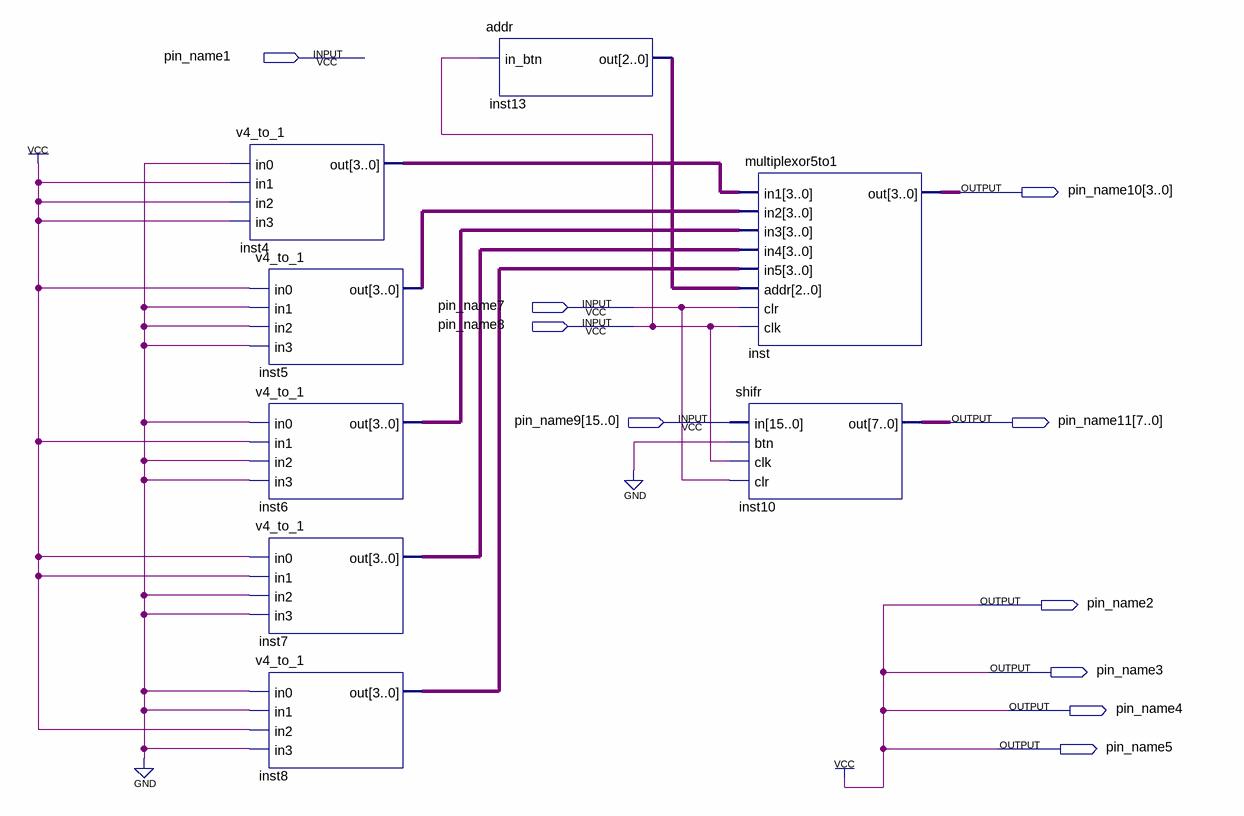
[diagram p0: schematic sheet]
// Quartus schematic lab3.bdf as structural Verilog: 8 symbols, 10 pins
module lab3 (
  input  pin_name1,
  input  pin_name7,
  input  pin_name8,
  input  [15:0] pin_name9,
  output [3:0] pin_name10,
  output [7:0] pin_name11,
  output pin_name2,
  output pin_name3,
  output pin_name4,
  output pin_name5
);

  wire [2:0] inst13_out;
  wire [3:0] inst4_out, inst5_out, inst6_out, inst7_out, inst8_out;

  v4_to_1 inst4 (.in0(1'b0), .in1(1'b1), .in2(1'b1), .in3(1'b1), .out(inst4_out));
  v4_to_1 inst5 (.in0(1'b1), .in1(1'b0), .in2(1'b0), .in3(1'b0), .out(inst5_out));
  v4_to_1 inst6 (.in0(1'b0), .in1(1'b1), .in2(1'b0), .in3(1'b0), .out(inst6_out));
  v4_to_1 inst7 (.in0(1'b1), .in1(1'b1), .in2(1'b0), .in3(1'b0), .out(inst7_out));
  v4_to_1 inst8 (.in0(1'b0), .in1(1'b0), .in2(1'b1), .in3(1'b0), .out(inst8_out));
  addr inst13 (.in_btn(pin_name8), .out(inst13_out));
  multiplexor5to1 inst (
    .in1(inst4_out), .in2(inst5_out), .in3(inst6_out), .in4(inst7_out), .in5(inst8_out), .addr(inst13_out),
    .clr(pin_name7), .clk(pin_name8), .out(pin_name10));
  shifr inst10 (.in(pin_name9), .btn(1'b0), .clk(pin_name8), .clr(pin_name7), .out(pin_name11));

  assign pin_name2 = 1'b1;
  assign pin_name3 = 1'b1;
  assign pin_name4 = 1'b1;
  assign pin_name5 = 1'b1;
endmodule
